# EAGLE schematic RingMod (EAGLE 9.5.2)
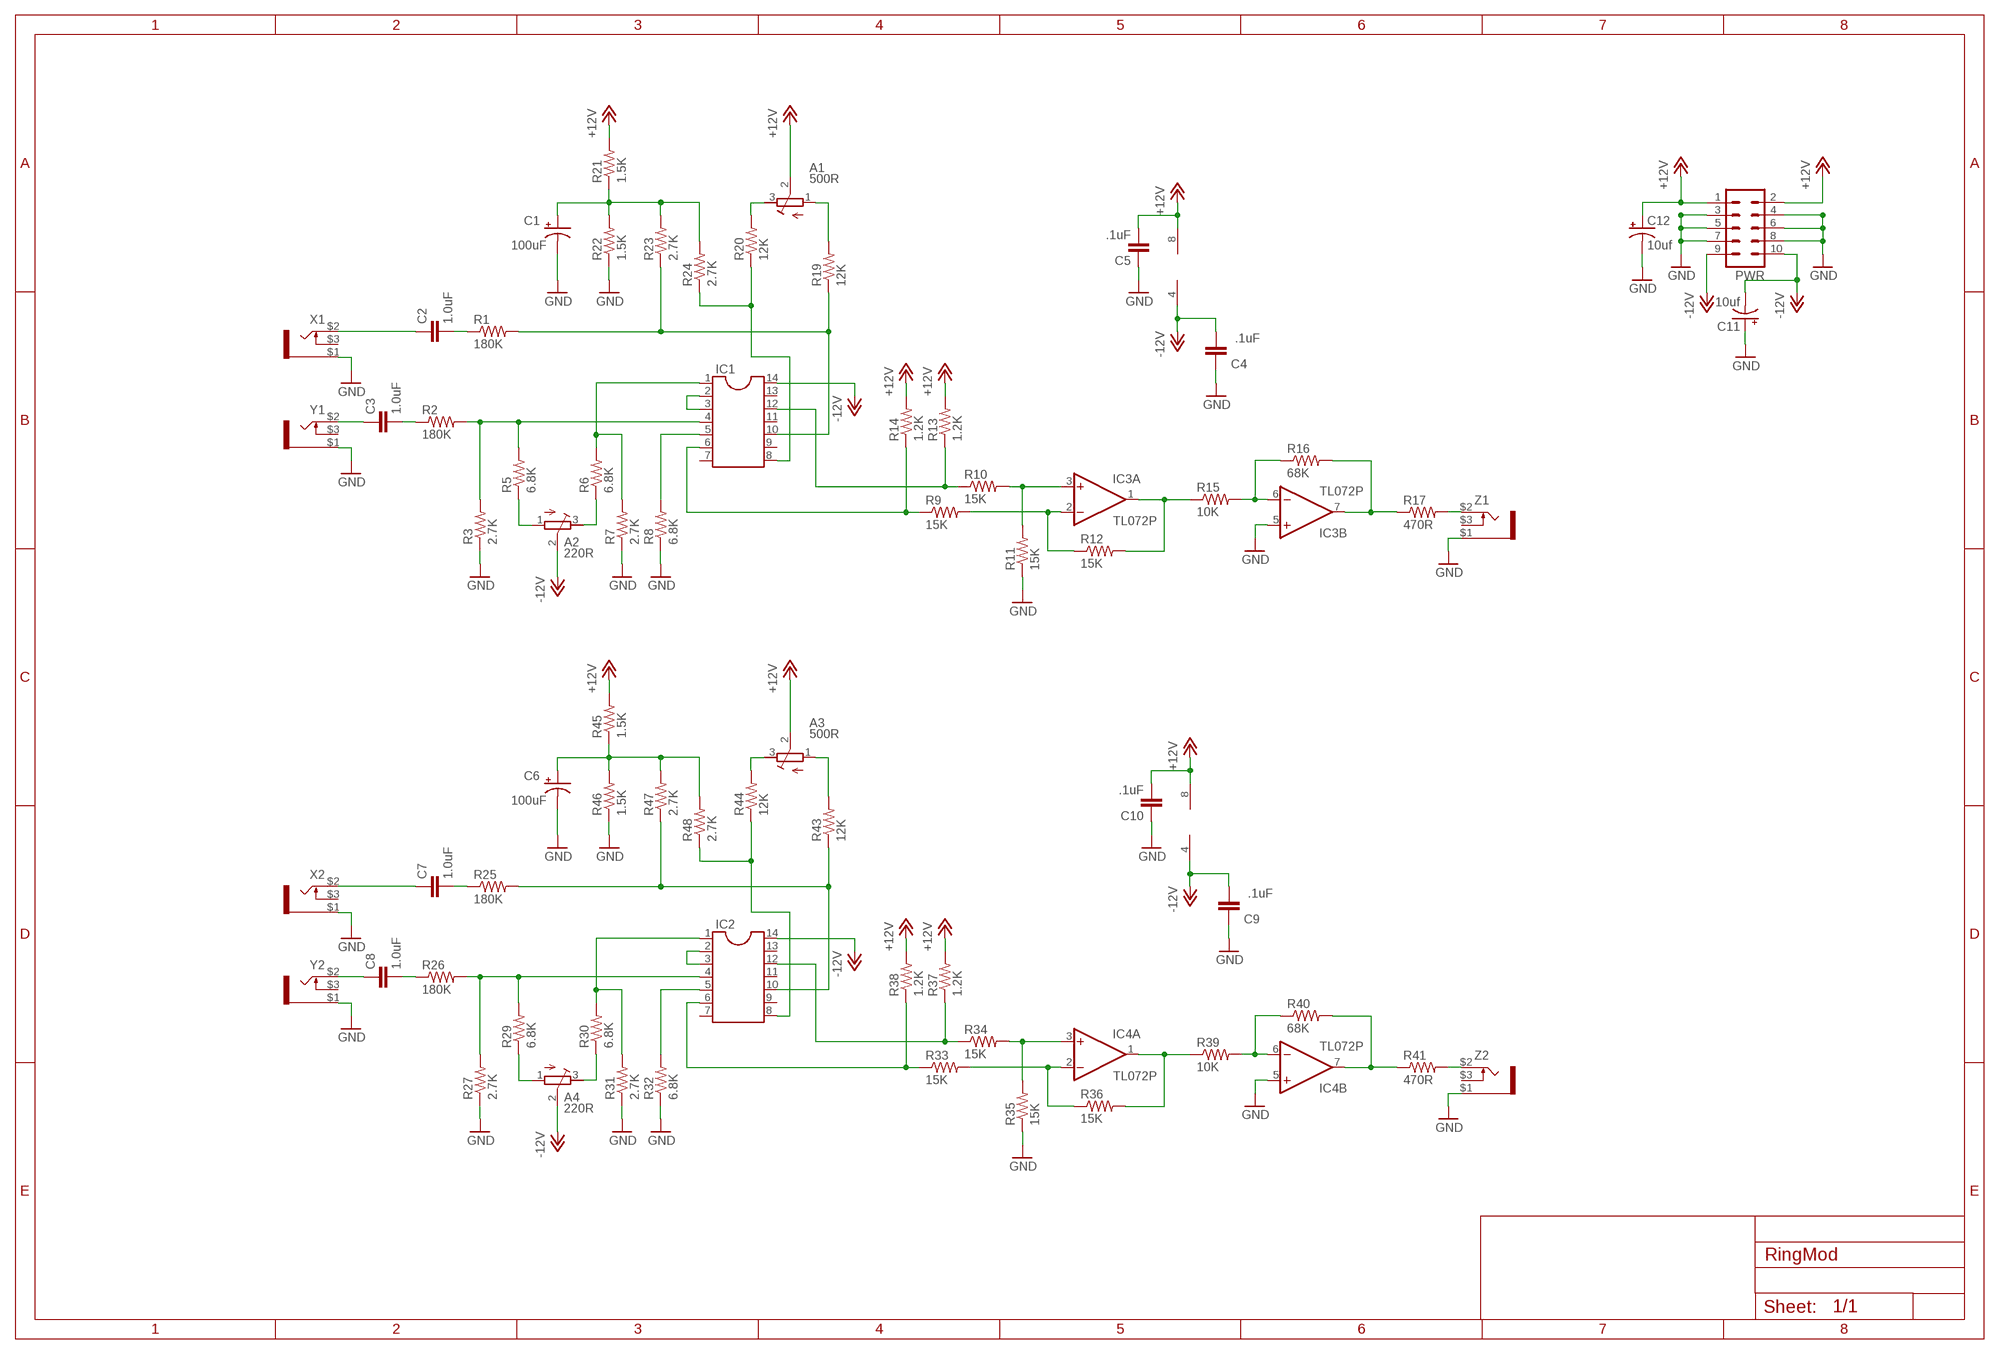
[diagram p0: schematic, sheet 1]

## Parts
A1  500R  R-TRIMM3296W  [RTRIM3296W]
A2  220R  R-TRIMM3296W  [RTRIM3296W]
A3  500R  R-TRIMM3296W  [RTRIM3296W]
A4  220R  R-TRIMM3296W  [RTRIM3296W]
C1  100uF  CPOL-USE2.5-6  [E2,5-6]
C2  1.0uF  C-EU050-024X044  [C050-024X044]
C3  1.0uF  C-EU050-024X044  [C050-024X044]
C4  .1uF  C-EU050-024X044  [C050-024X044]
C5  .1uF  C-EU050-024X044  [C050-024X044]
C6  100uF  CPOL-USE2.5-6  [E2,5-6]
C7  1.0uF  C-EU050-024X044  [C050-024X044]
C8  1.0uF  C-EU050-024X044  [C050-024X044]
C9  .1uF  C-EU050-024X044  [C050-024X044]
C10  .1uF  C-EU050-024X044  [C050-024X044]
C11  10uf  CPOL-USE2.5-5  [E2,5-5]
C12  10uf  CPOL-USE2.5-5  [E2,5-5]
IC1  LM1496  [LM1496]
IC2  LM1496  [LM1496]
IC3  TL072P  [DIL08]
IC4  TL072P  [DIL08]
PWR  ML10  [ML10]
R1  180K  R-US_0207/7  [0207/7]
R2  180K  R-US_0207/7  [0207/7]
R3  2.7K  R-US_0207/7  [0207/7]
R5  6.8K  R-US_0207/7  [0207/7]
R6  6.8K  R-US_0207/7  [0207/7]
R7  2.7K  R-US_0207/7  [0207/7]
R8  6.8K  R-US_0207/7  [0207/7]
R9  15K  R-US_0207/7  [0207/7]
R10  15K  R-US_0207/7  [0207/7]
R11  15K  R-US_0207/7  [0207/7]
R12  15K  R-US_0207/7  [0207/7]
R13  1.2K  R-US_0207/7  [0207/7]
R14  1.2K  R-US_0207/7  [0207/7]
R15  10K  R-US_0207/7  [0207/7]
R16  68K  R-US_0207/7  [0207/7]
R17  470R  R-US_0207/7  [0207/7]
R19  12K  R-US_0207/7  [0207/7]
R20  12K  R-US_0207/7  [0207/7]
R21  1.5K  R-US_0207/7  [0207/7]
R22  1.5K  R-US_0207/7  [0207/7]
R23  2.7K  R-US_0207/7  [0207/7]
R24  2.7K  R-US_0207/7  [0207/7]
R25  180K  R-US_0207/7  [0207/7]
R26  180K  R-US_0207/7  [0207/7]
R27  2.7K  R-US_0207/7  [0207/7]
R29  6.8K  R-US_0207/7  [0207/7]
R30  6.8K  R-US_0207/7  [0207/7]
R31  2.7K  R-US_0207/7  [0207/7]
R32  6.8K  R-US_0207/7  [0207/7]
R33  15K  R-US_0207/7  [0207/7]
R34  15K  R-US_0207/7  [0207/7]
R35  15K  R-US_0207/7  [0207/7]
R36  15K  R-US_0207/7  [0207/7]
R37  1.2K  R-US_0207/7  [0207/7]
R38  1.2K  R-US_0207/7  [0207/7]
R39  10K  R-US_0207/7  [0207/7]
R40  68K  R-US_0207/7  [0207/7]
R41  470R  R-US_0207/7  [0207/7]
R43  12K  R-US_0207/7  [0207/7]
R44  12K  R-US_0207/7  [0207/7]
R45  1.5K  R-US_0207/7  [0207/7]
R46  1.5K  R-US_0207/7  [0207/7]
R47  2.7K  R-US_0207/7  [0207/7]
R48  2.7K  R-US_0207/7  [0207/7]
X1  PJ-323PJ-323  [PJ-323]
X2  PJ-323PJ-323  [PJ-323]
Y1  PJ-323PJ-323  [PJ-323]
Y2  PJ-323PJ-323  [PJ-323]
Z1  PJ-323PJ-323  [PJ-323]
Z2  PJ-323PJ-323  [PJ-323]

## Nets
+12V: A1.2(S) A3.2(S) C5.2 C10.2 C12.+ IC3.8(P:V+) IC4.8(P:V+) PWR.1 PWR.2 R13.2 R14.2 R21.2 R37.2 R38.2 R45.2
-12V: A2.2(S) A4.2(S) C4.2 C9.2 C11.- IC1.14 IC2.14 IC3.4(P:V-) IC4.4(P:V-) PWR.9 PWR.10
GND: C1.- C4.1 C5.1 C6.- C9.1 C10.1 C11.+ C12.- IC3.5(B:+IN) IC4.5(B:+IN) PWR.3 PWR.4 PWR.5 PWR.6 PWR.7 PWR.8 R3.1 R7.1 R8.1 R11.1 R22.1 R27.1 R31.1 R32.1 R35.1 R46.1 X1.$1 X2.$1 Y1.$1 Y2.$1 Z1.$1 Z2.$1
N$1: C2.1 X1.$2
N$2: C3.1 Y1.$2
N$3: C2.2 R1.1
N$4: C3.2 R2.1
N$5: IC1.2 IC1.3
N$6: IC1.4 R2.2 R3.2 R5.2
N$7: C1.+ R21.1 R22.2 R23.2 R24.2
N$8: A2.1(A) R5.1
N$9: IC1.1 R6.2 R7.2
N$10: A2.3(E) R6.1
N$11: IC1.5 R8.2
N$12: IC1.6 R9.1 R14.1
N$13: IC3.2(A:-IN) R9.2 R12.1
N$14: IC1.12 R10.1 R13.1
N$15: IC3.3(A:+IN) R10.2 R11.2
N$16: IC3.1(A:OUT) R12.2 R15.1
N$17: IC3.6(B:-IN) R15.2 R16.1
N$18: R17.2 Z1.$2
N$19: IC3.7(B:OUT) R16.2 R17.1
N$20: A1.3(E) R20.2
N$21: IC1.8 R20.1 R24.1
N$22: A1.1(A) R19.2
N$23: IC1.10 R1.2 R19.1 R23.1
N$24: C7.1 X2.$2
N$25: C8.1 Y2.$2
N$26: C7.2 R25.1
N$27: C8.2 R26.1
N$28: IC2.2 IC2.3
N$29: IC2.4 R26.2 R27.2 R29.2
N$30: A4.1(A) R29.1
N$31: IC2.1 R30.2 R31.2
N$32: A4.3(E) R30.1
N$33: IC2.5 R32.2
N$34: IC2.6 R33.1 R38.1
N$35: IC4.2(A:-IN) R33.2 R36.1
N$36: IC2.12 R34.1 R37.1
N$37: IC4.3(A:+IN) R34.2 R35.2
N$38: IC4.1(A:OUT) R36.2 R39.1
N$39: IC4.6(B:-IN) R39.2 R40.1
N$40: IC4.7(B:OUT) R40.2 R41.1
N$41: R41.2 Z2.$2
N$42: IC2.8 R44.1 R48.1
N$43: A3.1(A) R43.2
N$44: A3.3(E) R44.2
N$45: IC2.10 R25.2 R43.1 R47.1
N$46: C6.+ R45.1 R46.2 R47.2 R48.2
Unconnected: IC1.7 IC1.9 IC1.11 IC1.13 IC2.7 IC2.9 IC2.11 IC2.13 X1.$3 X2.$3 Y1.$3 Y2.$3 Z1.$3 Z2.$3

## Library data of the parts
A1-A4 = resistor:R-TRIMM: Trimm resistor
C1 C6 C11 C12 = resistor:CPOL-US: POLARIZED CAPACITOR, American symbol
C2-C5 C7-C10 = resistor:C-EU: CAPACITOR, European symbol
IC1 IC2 = gerbster:LM1496: Dual In Line / Socket
IC3 IC4 = TomW:TL072: OP AMP
PWR = con-ml:ML10: HARTING; OC_FARNELL: unknown; OC_NEWARK: unknown
R1-R3 R5-R17 R19-R27 R29-R41 R43-R48 = resistor:R-US_: RESISTOR, American symbol
X1 X2 Y1 Y2 Z1 Z2 = gerbster:PJ-323